# Altium schematic sheet DBG.SchDoc: DEBBUG
size A2; DrawnBy: ELIO F.; Engineer: ELIO F.; Revision: A; SheetNumber: 14; SheetTotal: 22
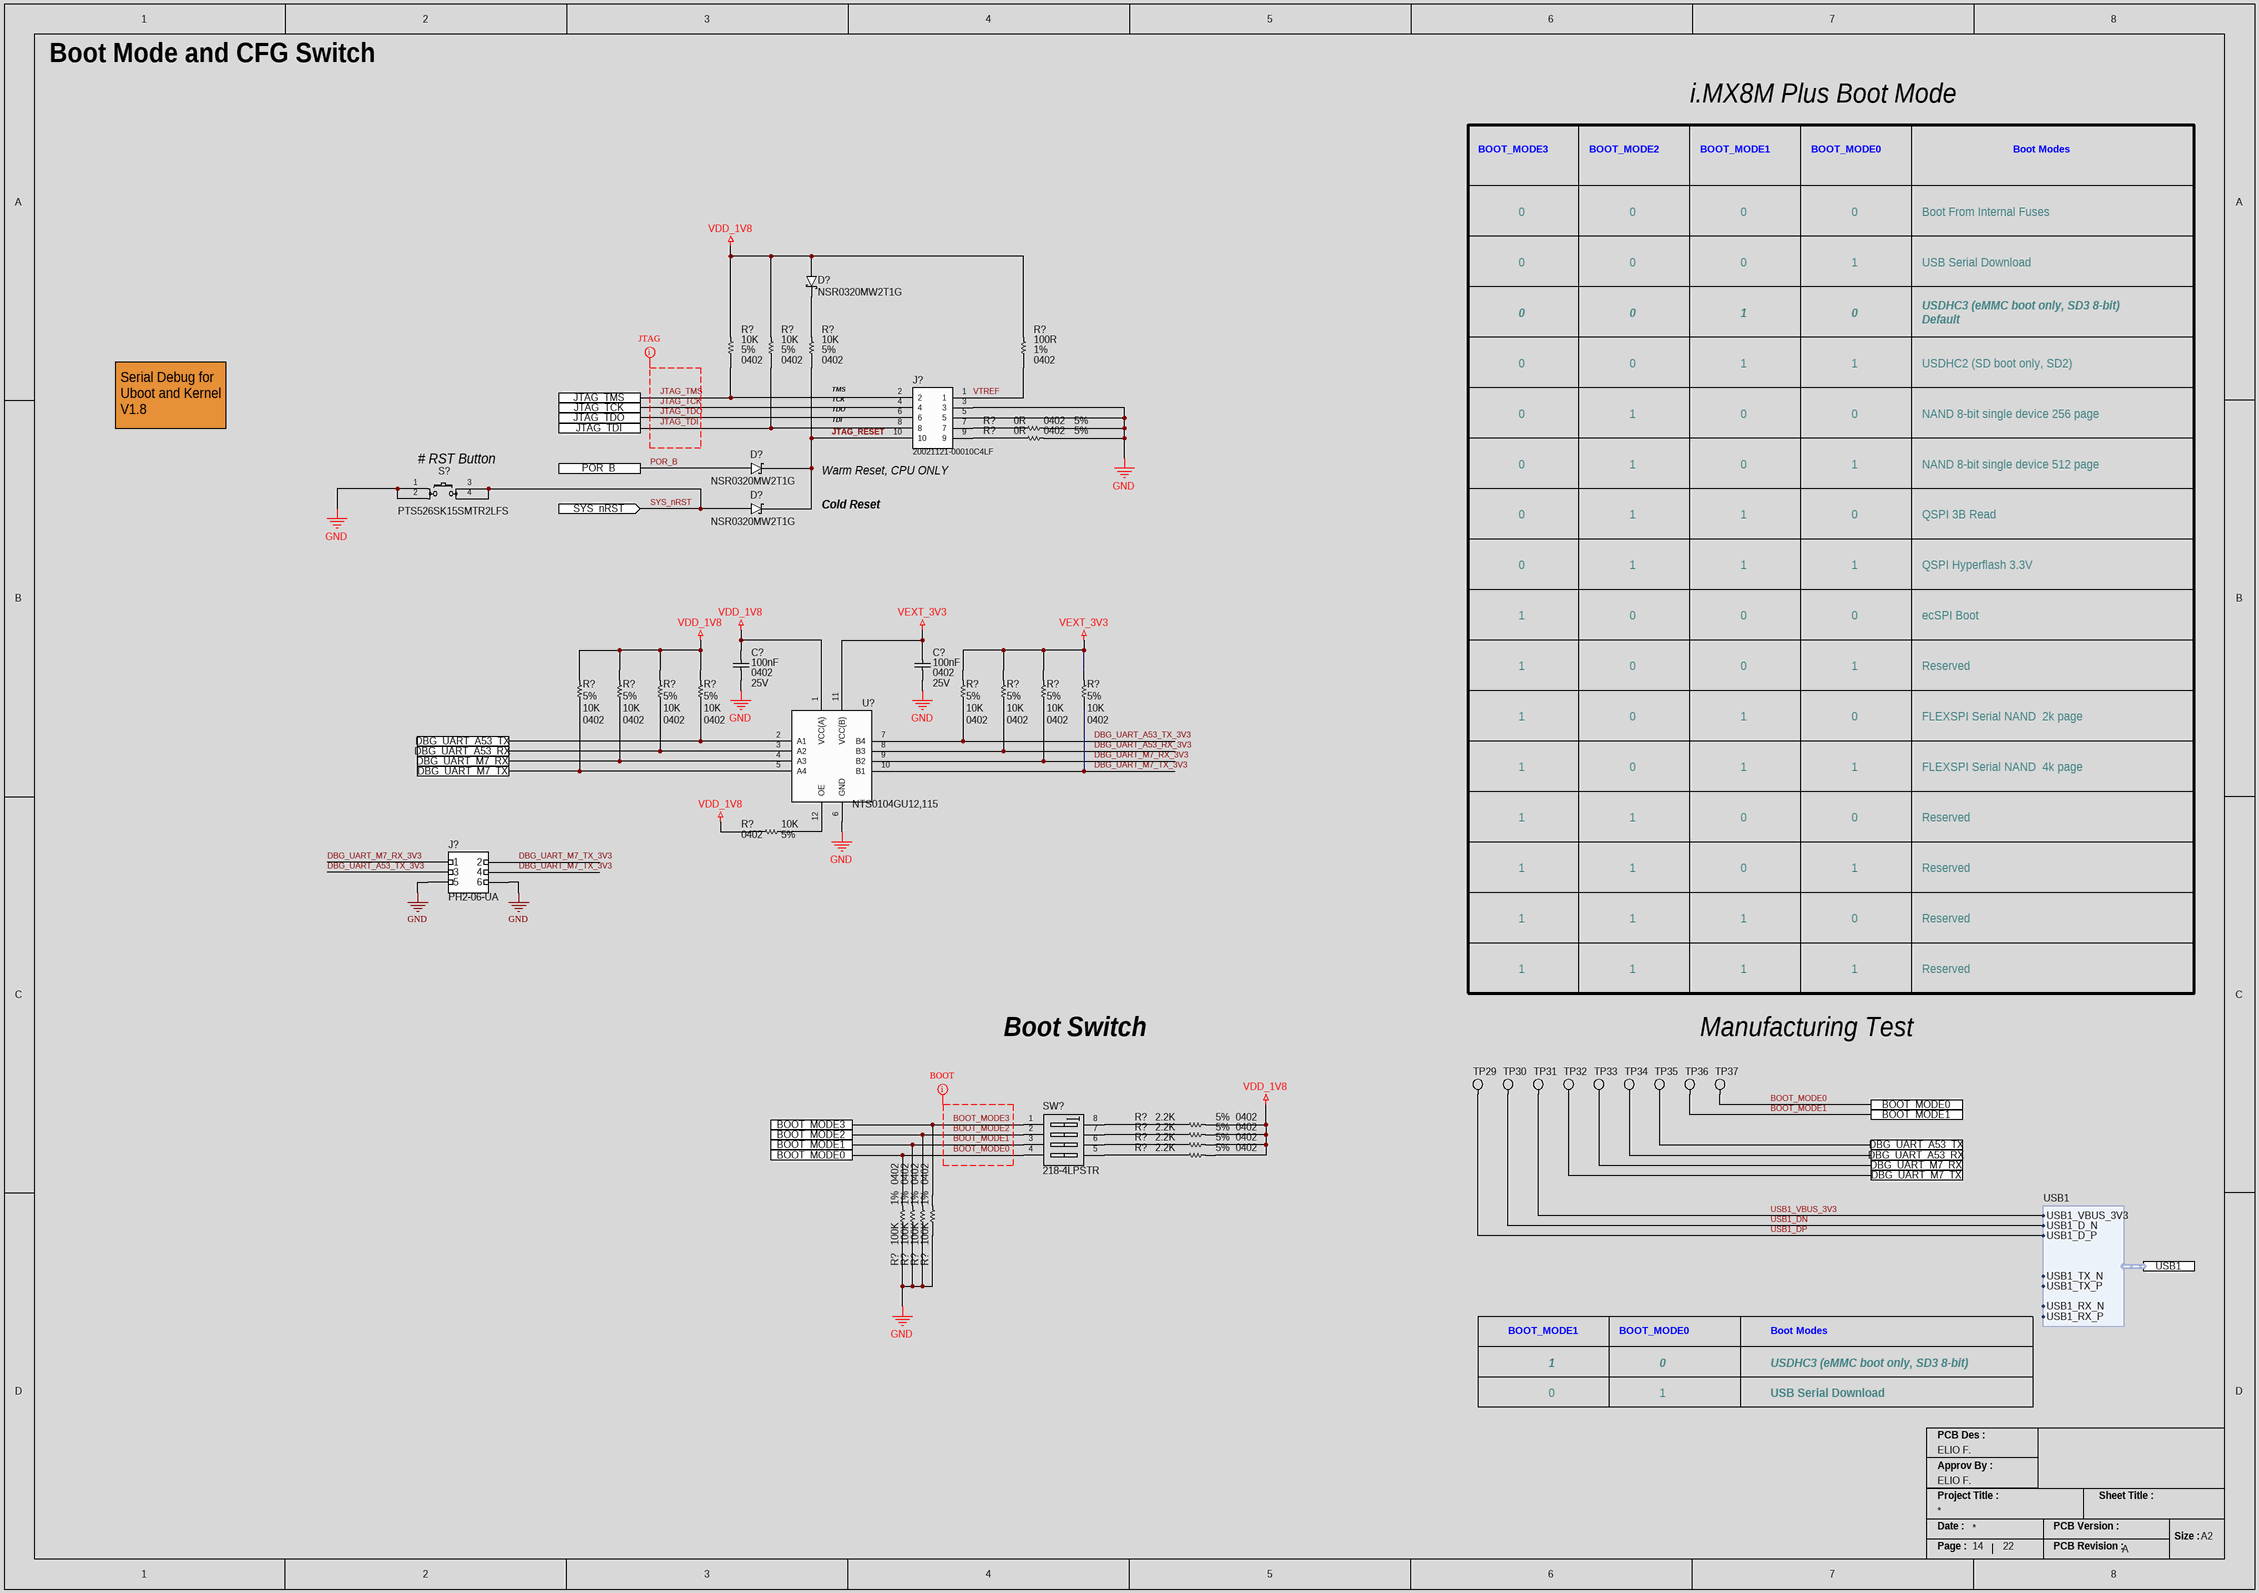
[diagram p0: DBG.SchDoc]

## Parts
(Parts that share a designator on the sheet are numbered #1, #2 ... from top to bottom, then left to right.)
C?#1  Capacitance: 100nF  Voltage Rating: 25V  Case/Package: 0402  [CAP_0402_CAPC1005X05N]  (hidden comment: CC0402KRX5R8BB104)
C?#2  Capacitance: 100nF  Voltage Rating: 25V  Case/Package: 0402  [CAP_0402_CAPC1005X05N]  (hidden comment: CC0402KRX5R8BB104)
D?#1  NSR0320MW2T1G  [DIO_SOD2512X110N]
D?#2  NSR0320MW2T1G  [DIO_SOD2512X110N]
D?#3  NSR0320MW2T1G  [DIO_SOD2512X110N]
J?#1  20021121-00010C4LF  [CONN_HDR_MALE_10P_2R]
J?#2  PH2-06-UA  [CONN_HDR_HDRV6W64P254_2X3_762X500X901P]
R?#1  Tolerance: 5%  Resistance: 10K  Case/Package: 0402  [RES_0402_RESC1005X04N]  (hidden comment: ERJ-2GEJ103X)
R?#2  Tolerance: 5%  Resistance: 10K  Case/Package: 0402  [RES_0402_RESC1005X04N]  (hidden comment: ERJ-2GEJ103X)
R?#3  Tolerance: 5%  Resistance: 10K  Case/Package: 0402  [RES_0402_RESC1005X04N]  (hidden comment: ERJ-2GEJ103X)
R?#4  Tolerance: 1%  Resistance: 100R  Case/Package: 0402  [RES_0402_RESC1005X04N]  (hidden comment: ERJ-2RKF1000X)
R?#5  Case Code (Imperial): 0402  Tolerance: 5%  Resistance: 0R  [RES_0402_RESC1005X04N]  (hidden comment: ERJ-2GE0R00X)
R?#6  Case Code (Imperial): 0402  Tolerance: 5%  Resistance: 0R  [RES_0402_RESC1005X04N]  (hidden comment: ERJ-2GE0R00X)
R?#7  Tolerance: 5%  Resistance: 10K  Case/Package: 0402  [RES_0402_RESC1005X04N]  (hidden comment: ERJ-2GEJ103X)
R?#8  Tolerance: 5%  Resistance: 10K  Case/Package: 0402  [RES_0402_RESC1005X04N]  (hidden comment: ERJ-2GEJ103X)
R?#9  Tolerance: 5%  Resistance: 10K  Case/Package: 0402  [RES_0402_RESC1005X04N]  (hidden comment: ERJ-2GEJ103X)
R?#10  Tolerance: 5%  Resistance: 10K  Case/Package: 0402  [RES_0402_RESC1005X04N]  (hidden comment: ERJ-2GEJ103X)
R?#11  Tolerance: 5%  Resistance: 10K  Case/Package: 0402  [RES_0402_RESC1005X04N]  (hidden comment: ERJ-2GEJ103X)
R?#12  Tolerance: 5%  Resistance: 10K  Case/Package: 0402  [RES_0402_RESC1005X04N]  (hidden comment: ERJ-2GEJ103X)
R?#13  Tolerance: 5%  Resistance: 10K  Case/Package: 0402  [RES_0402_RESC1005X04N]  (hidden comment: ERJ-2GEJ103X)
R?#14  Tolerance: 5%  Resistance: 10K  Case/Package: 0402  [RES_0402_RESC1005X04N]  (hidden comment: ERJ-2GEJ103X)
R?#15  Tolerance: 5%  Resistance: 10K  Case/Package: 0402  [RES_0402_RESC1005X04N]  (hidden comment: ERJ-2GEJ103X)
R?#16  Tolerance: 5%  Resistance: 2.2K  Case/Package: 0402  [RES_0402_RESC1005X04N]  (hidden comment: RC0402JR-072K2L)
R?#17  Tolerance: 5%  Resistance: 2.2K  Case/Package: 0402  [RES_0402_RESC1005X04N]  (hidden comment: RC0402JR-072K2L)
R?#18  Tolerance: 5%  Resistance: 2.2K  Case/Package: 0402  [RES_0402_RESC1005X04N]  (hidden comment: RC0402JR-072K2L)
R?#19  Tolerance: 5%  Resistance: 2.2K  Case/Package: 0402  [RES_0402_RESC1005X04N]  (hidden comment: RC0402JR-072K2L)
R?#20  Resistance: 100K  Tolerance: 1%  Case/Package: 0402  [RES_0402_RESC1005X04N]  (hidden comment: RC0402FR-07100KL)
R?#21  Resistance: 100K  Tolerance: 1%  Case/Package: 0402  [RES_0402_RESC1005X04N]  (hidden comment: RC0402FR-07100KL)
R?#22  Resistance: 100K  Tolerance: 1%  Case/Package: 0402  [RES_0402_RESC1005X04N]  (hidden comment: RC0402FR-07100KL)
R?#23  Resistance: 100K  Tolerance: 1%  Case/Package: 0402  [RES_0402_RESC1005X04N]  (hidden comment: RC0402FR-07100KL)
S?  PTS526SK15SMTR2LFS  [SWT_NO_PTS526SK15SMTR2LFS]
SW?  218-4LPSTR  [SW_DIP_SOIC127P844X265-8N]
TP29  NO COMPONENT  [TP_PAD_0.5MM_SMD_ROUND]  (value not drawn)  (no BOM)
TP30  NO COMPONENT  [TP_PAD_0.5MM_SMD_ROUND]  (value not drawn)  (no BOM)
TP31  NO COMPONENT  [TP_PAD_0.5MM_SMD_ROUND]  (value not drawn)  (no BOM)
TP32  NO COMPONENT  [TP_PAD_0.5MM_SMD_ROUND]  (value not drawn)  (no BOM)
TP33  NO COMPONENT  [TP_PAD_0.5MM_SMD_ROUND]  (value not drawn)  (no BOM)
TP34  NO COMPONENT  [TP_PAD_0.5MM_SMD_ROUND]  (value not drawn)  (no BOM)
TP35  NO COMPONENT  [TP_PAD_0.5MM_SMD_ROUND]  (value not drawn)  (no BOM)
TP36  NO COMPONENT  [TP_PAD_0.5MM_SMD_ROUND]  (value not drawn)  (no BOM)
TP37  NO COMPONENT  [TP_PAD_0.5MM_SMD_ROUND]  (value not drawn)  (no BOM)
U?  NTS0104GU12,115  [IC_LEVEL_TRASLATOR_XQFN12_0P4_1P8X2P1]

## Ports
BOOT_MODE0, BOOT_MODE1, BOOT_MODE2, BOOT_MODE3, DBG_UART_A53_RX, DBG_UART_A53_TX, DBG_UART_M7_RX, DBG_UART_M7_TX, JTAG_TCK, JTAG_TDI, JTAG_TDO, JTAG_TMS, POR_B, SYS_nRST (in), USB1 (harness USB1)

## Harnesses
USB1: USB1_VBUS_3V3, USB1_D_N, USB1_D_P, USB1_TX_N, USB1_TX_P, USB1_RX_N, USB1_RX_P

## Nets
GND: C?#1.1 C?#2.1 J?#1.3 J?#1.5 J?#2.5 J?#2.6 R?#5.2 R?#6.2 R?#20.1 R?#21.1 R?#22.1 R?#23.1 S?.1(COM_1) S?.2(COM2) U?.6(GND)
VDD_1V8: C?#1.2 D?#1.2(A) R?#1.2 R?#2.2 R?#4.2 R?#7.2 R?#8.2 R?#9.2 R?#10.2 R?#15.1 R?#16.2 R?#17.2 R?#18.2 R?#19.2 U?.1(VCC(A))
VEXT_3V3: C?#2.2 R?#11.2 R?#12.2 R?#13.2 R?#14.2 U?.11(VCC(B))
BOOT_MODE0: R?#20.2 SW?.4(A4) TP37.1 ; port BOOT_MODE0
BOOT_MODE1: R?#21.2 SW?.3(A3) TP36.1 ; port BOOT_MODE1
BOOT_MODE2: R?#22.2 SW?.2(A2) ; port BOOT_MODE2
BOOT_MODE3: R?#23.2 SW?.1(A1) ; port BOOT_MODE3
DBG_UART_A53_RX: R?#9.1 TP34.1 U?.3(A2) ; port DBG_UART_A53_RX
DBG_UART_A53_RX_3V3: R?#12.1 U?.8(B3)
DBG_UART_A53_TX: R?#10.1 TP35.1 U?.2(A1) ; port DBG_UART_A53_TX
DBG_UART_A53_TX_3V3: J?#2.3 R?#11.1 U?.7(B4)
DBG_UART_M7_RX: R?#8.1 TP33.1 U?.4(A3) ; port DBG_UART_M7_RX
DBG_UART_M7_RX_3V3: J?#2.1 R?#13.1 U?.9(B2)
DBG_UART_M7_TX: R?#7.1 TP32.1 U?.5(A4) ; port DBG_UART_M7_TX
DBG_UART_M7_TX_3V3: J?#2.2 J?#2.4 R?#14.1 U?.10(B1)
JTAG_RESET: D?#2.1(K) D?#3.1(K) J?#1.10 R?#3.1
JTAG_TCK: J?#1.4 ; port JTAG_TCK
JTAG_TDI: J?#1.8 R?#2.1 ; port JTAG_TDI
JTAG_TDO: J?#1.6 ; port JTAG_TDO
JTAG_TMS: J?#1.2 R?#1.1 ; port JTAG_TMS
POR_B: D?#2.2(A) ; port POR_B
SYS_nRST: D?#3.2(A) S?.3(NO1) S?.4(NO2) ; port SYS_nRST
USB1_DN: TP30.1 ; port USB1.USB1_D_N
USB1_DP: TP29.1 ; port USB1.USB1_D_P
USB1_VBUS_3V3: TP31.1 ; port USB1.USB1_VBUS_3V3
VTREF: J?#1.1 R?#4.1
NetD?#1_1: D?#1.1(K) R?#3.2
NetJ?#1_7: J?#1.7 R?#5.1
NetJ?#1_9: J?#1.9 R?#6.1
NetR?#15_2: R?#15.2 U?.12(OE)
NetR?#16_1: R?#16.1 SW?.8(B1)
NetR?#17_1: R?#17.1 SW?.7(B2)
NetR?#18_1: R?#18.1 SW?.6(B3)
NetR?#19_1: R?#19.1 SW?.5(B4)

## Layout directives
mark named BOOT: BOOT_MODE0, BOOT_MODE1, BOOT_MODE2, BOOT_MODE3
net class JTAG: JTAG_TCK, JTAG_TDI, JTAG_TDO, JTAG_TMS

## Notes on the sheet
- Boot Mode and CFG Switch
- i.MX8M Plus Boot Mode
- BOOT_MODE3
- BOOT_MODE2
- BOOT_MODE1
- BOOT_MODE0
- Boot Modes
- 0
- Boot From Internal Fuses
- 1
- USB Serial Download
- USDHC3 (eMMC boot only, SD3 8-bit)
  Default
- (near R?#3) TMS
- USDHC2 (SD boot only, SD2)
- Serial Debug for
  Uboot and Kernel V1.8
- TCK
- TDO
- TDI
- NAND 8-bit single device 256 page
- (near S?) # RST Button
- (near J?#1) Warm Reset, CPU ONLY
- NAND 8-bit single device 512 page
- Cold Reset
- QSPI 3B Read
- QSPI Hyperflash 3.3V
- ecSPI Boot
- Reserved
- FLEXSPI Serial NAND  2k page
- FLEXSPI Serial NAND  4k page
- Boot Switch
- Manufacturing Test
- USDHC3 (eMMC boot only, SD3 8-bit)
- PCB Des :
- Approv By :
- Project Title :
- Sheet Title :
- Date :
- Page :
- PCB Version :
- PCB Revision :
- Size :
- A2

## Library data of the parts
C?#1 C?#2 = CAP_100NF_25V_X7R_0402: Multilayer Ceramic Capacitor, 0.1 uF, 25 V, ± 10%, X7R, 0402 [1005 Metric]; Manufacturer: Yageo; Material: 4241ConductorMaterial; Dielectric: X5R; Temperature Coefficient: 30ppm/°C; Supplier 1: Digikey; Manufacturer Part Number: CC0402KRX5R8BB104; RoHS: Yes; Category: Ceramic Capacitors; Stock 1: 3706055; Pricing 1: 1=0.1, 10=0.037, 50=0.021, 100=0.0162, 500=0.01224, 1000=0.00961, 2500=0.00874, 5000=0.00804 (USD); Mount: Surface Mount; Case Code (Metric): 1005; Case Code (Imperial): 0402; Min Operating Temperature: -55°C; Max Operating Temperature: 85°C; Tolerance: 10%; Packaging: Tape and Reel; Voltage Rating (DC): 25V; Series: CC; RoHS Compliant: Yes; Lead Free: 5697LeadFree; Halogen Free: 5694HalogenFree; ComponentLink1URL: http://www.mouser.com/ds/2/447/UPY-GPHC_X5R_4V-to-50V_25-1131599.pdf?src-supplier=Mouser; ComponentLink1Description: http://www.mouser.com/ds/2/447/UPY-GPHC_X5R_4V-to-50V_25-1131599.pdf?src-supplier=Mouser; ComponentLink2URL: https://datasheet.octopart.com/CC0402KRX5R8BB104-Yageo-datasheet-137700082.pdf?src-supplier=Future+Electronics; ComponentLink2Description: https://datasheet.octopart.com/CC0402KRX5R8BB104-Yageo-datasheet-137700082.pdf?src-supplier=Future+Electronics; ComponentLink3URL: http://www.yageo.com/documents/recent/UPY-GPHC_X5R_4V-to-50V_25.pdf?src-supplier=Digikey; ComponentLink3Description: http://www.yageo.com/documents/recent/UPY-GPHC_X5R_4V-to-50V_25.pdf?src-supplier=Digikey; ComponentLink4URL: https://datasheet.octopart.com/CC0402KRX5R8BB104-Yageo-datasheet-140260304.pdf?src-supplier=Newark; ComponentLink4Description: https://datasheet.octopart.com/CC0402KRX5R8BB104-Yageo-datasheet-140260304.pdf?src-supplier=Newark; ComponentLink5URL: https://datasheet.octopart.com/CC0402KRX5R8BB104-Yageo-datasheet-170350636.pdf?src-supplier=Future+Electronics; ComponentLink5Description: https://datasheet.octopart.com/CC0402KRX5R8BB104-Yageo-datasheet-170350636.pdf?src-supplier=Future+Electronics; ComponentLink6URL: http://www.yageo.com/documents/recent/UPY-GPHC_X5R_4V-to-50V-16.pdf?src-supplier=Future+Electronics; ComponentLink6Description: http://www.yageo.com/documents/recent/UPY-GPHC_X5R_4V-to-50V-16.pdf?src-supplier=Future+Electronics; Supplier Part Number 1: 311-1697-6-ND
D?#1-D?#3 = DIO_SCTKY_20V_1A_NSR0320MW2T1G: VR=20V IF=1A 29pF P=200mW; Manufacturer: ON Semiconductor; Forward Current: 1A; Max Reverse Current: 50uA; Forward Voltage: 500mV; Max Repetitive Reverse Voltage (Vrrm): 23V; Max Forward Surge Current (Ifsm): 5A; Power Dissipation: 200mW; Element Configuration: Single; Max Reverse Voltage (DC): 20V; Supplier 1: Digikey; Manufacturer Part Number: NSR0320MW2T1G; RoHS: Yes; Category: Schottky Diodes; Stock 1: 158845; Pricing 1: 1=0.32, 10=0.223, 100=0.1089, 500=0.09082, 1000=0.0631 (USD); Case/Package: SOD-323-2; Number of Pins: 2; Min Operating Temperature: -55°C; Max Operating Temperature: 125°C; Package Quantity: 1; Packaging: Tape and Reel; Average Rectified Current: 1A; Max Reverse Leakage Current: 50uA; Series: -; Length: 1.8mm; Width: 1.35mm; Height: 0.9mm; Radiation Hardening: No; Reach SVHC Compliant: No; Lead Free: Lead Free; RoHS Compliant: Yes; ComponentLink1URL: https://datasheet.ciiva.com/915/nsr0320mw2t1-d-915506.pdf?src-supplier=Avnet; ComponentLink1Description: https://datasheet.ciiva.com/915/nsr0320mw2t1-d-915506.pdf?src-supplier=Avnet; ComponentLink2URL: https://datasheet.ciiva.com/22659/1708337-22659115.pdf?src-supplier=Element14; ComponentLink2Description: https://datasheet.ciiva.com/22659/1708337-22659115.pdf?src-supplier=Element14; ComponentLink3URL: https://datasheet.ciiva.com/16210/nsr0320mw2t1-d-16210139.pdf?src-supplier=Future+Electronics; ComponentLink3Description: https://datasheet.ciiva.com/16210/nsr0320mw2t1-d-16210139.pdf?src-supplier=Future+Electronics; Supplier Part Number 1: NSR0320MW2T1GOSCT-ND
J?#1 = CONN_HEADER_MALE_10P_2R_1.27MM: Conn Unshrouded Header HDR 10 POS 1.27mm Solder ST Top Entry SMD Minitek127® T/R; Manufacturer: Amphenol ICC / FCI; Number of Contacts: 10; Current Rating: 1A; Voltage Rating: 125V; Contact Resistance: 30mR; Row Spacing: 0.05inch; Stack Height: 3mm; Supplier 1: Newark; Manufacturer Part Number: 20021121-00010C4LF; RoHS: No; Category: Headers and Wire Housings; Stock 1: 9600; Pricing 1: 1=0.363, 1200=0.363, 2400=0.363, 4800=0.363, 7200=0.363, 12000=0.363 (USD); Mount: Surface Mount; Contact Plating: Gold; Color: Black; Contact Material: Copper Alloy,Copper; Housing Material: Thermoplastic; Housing Color: Black; Min Operating Temperature: -40°C; Max Operating Temperature: 85°C; Series: Minitek; Packaging: Tape and Reel; Number of Rows: 2; Termination: Solder; Package Quantity: 600; Connector Type: Header; Contact Type: Male Pin; Number of Positions: 10; Orientation: Straight; Max Voltage Rating (AC): 125V; Length: 6.35mm; Pitch: 1.27mm; Contact Mating Length: 0.12inch; Depth: 3.4mm; Radiation Hardening: No; Reach SVHC Compliant: No; Supplier Part Number 1: 28X2682
J?#2 = CONN_HEADER_MALE_6P_2R_2.54mm_PH2-06-UA: Conn Unshrouded Header HDR 6 POS 2.54mm Solder ST Thru-Hole Bag; Manufacturer: Adam Equipment; Supplier 1: Digi-Key; Manufacturer Part Number: PH2-06-UA; RoHS: Yes; Category: Connectors; Stock 1: 52253; Pricing 1: 1=0.13, 10=0.1, 100=0.0735, 500=0.06084, 1000=0.05324, 5000=0.04563, 10000=0.04436 (USD); Lead Free: Lead Free; ComponentLink1URL: https://datasheet.ciiva.com/16479/page-292-295-16479745.pdf?src-supplier=Future+Electronics; ComponentLink1Description: https://datasheet.ciiva.com/16479/page-292-295-16479745.pdf?src-supplier=Future+Electronics; Supplier Part Number 1: 2057-PH2-06-UA-ND
R?#1-R?#3 R?#7-R?#15 = RES_10K_5%_100mW_0402: Res Thick Film 0402 10K Ohm 5% 1/10W ±200ppm/°C Molded SMD Punched Carrier T/R; Manufacturer: Panasonic; Power Rating: 100mW; Voltage Rating: 50V; Supplier 1: Digi-Key; Manufacturer Part Number: ERJ-2GEJ103X; RoHS: Yes; Category: Chip SMD Resistors; Stock 1: 4696986; Pricing 1: 1=0.1, 10=0.021, 50=0.0132, 100=0.011, 500=0.00744, 1000=0.00639, 5000=0.00464 (USD); Mount: Surface Mount; Contact Plating: Tin; Case Code (Metric): 1005; Case Code (Imperial): 0402; Size Code: 0402; Min Operating Temperature: -55°C; Max Operating Temperature: 155°C; Temperature Coefficient: 200ppm/°C; Packaging: Cut Tape; Resistor Type: Thick Film; Package Quantity: 10000; Number of Terminations: 2; Termination: SMD/SMT; Max Power Dissipation: 100mW; Features: Automotive AEC-Q200; Series: ERJ; Resistance Tolerance: 5%; Technology: THICK FILM; Voltage Rating (DC): 50V; Length: 1mm; Width: 0.5mm; Height: 0.35mm; Depth: 0.5mm; Ratings: AEC-Q200; Radiation Hardening: No; Reach SVHC Compliant: No; RoHS Compliant: Yes; Lead Free: 5697LeadFree; ComponentLink1URL: https://datasheet.ciiva.com/27055/1935721-27055112.pdf?src-supplier=Jameco; ComponentLink1Description: https://datasheet.ciiva.com/27055/1935721-27055112.pdf?src-supplier=Jameco; ComponentLink2URL: https://datasheet.ciiva.com/11821/0900766b80f806dd-11821170.pdf?src-supplier=Rs; ComponentLink2Description: https://datasheet.ciiva.com/11821/0900766b80f806dd-11821170.pdf?src-supplier=Rs; ComponentLink3URL: https://datasheet.ciiva.com/43460/1678796-43460391.pdf?src-supplier=Farnell; ComponentLink3Description: https://datasheet.ciiva.com/43460/1678796-43460391.pdf?src-supplier=Farnell; ComponentLink4URL: https://datasheet.ciiva.com/22785/1678796-22785949.pdf?src-supplier=Farnell; ComponentLink4Description: https://datasheet.ciiva.com/22785/1678796-22785949.pdf?src-supplier=Farnell; ComponentLink5URL: https://datasheet.ciiva.com/46371/1678796-46371910.pdf?src-supplier=Element14; ComponentLink5Description: https://datasheet.ciiva.com/46371/1678796-46371910.pdf?src-supplier=Element14; ComponentLink6URL: https://datasheet.ciiva.com/28514/1678796-28514154.pdf?src-supplier=Element14; ComponentLink6Description: https://datasheet.ciiva.com/28514/1678796-28514154.pdf?src-supplier=Element14; ComponentLink7URL: https://datasheet.ciiva.com/24070/aoa0000ce1-37422-24070679.pdf?src-supplier=Mouser; ComponentLink7Description: https://datasheet.ciiva.com/24070/aoa0000ce1-37422-24070679.pdf?src-supplier=Mouser; ComponentLink8URL: https://datasheet.ciiva.com/16767/70260739-16767130.pdf?src-supplier=Allied+Electronics; ComponentLink8Description: https://datasheet.ciiva.com/16767/70260739-16767130.pdf?src-supplier=Allied+Electronics; ComponentLink9URL: https://datasheet.ciiva.com/16774/70260739-16774504.pdf?src-supplier=Allied+Electronics; ComponentLink9Description: https://datasheet.ciiva.com/16774/70260739-16774504.pdf?src-supplier=Allied+Electronics; ComponentLink10URL: https://datasheet.ciiva.com/9194/aoa0000ce1-9194140.pdf?src-supplier=Avnet; ComponentLink10Description: https://datasheet.ciiva.com/9194/aoa0000ce1-9194140.pdf?src-supplier=Avnet; Supplier Part Number 1: P10KJCT-ND
R?#4 = RES_100R_1%_100mW_0402: Resistor Thick Film 0402 100 Ohm 1% 1/10W 100ppm/C Molded SMD Punched Carrier T/R; Manufacturer: Panasonic; Temperature Coefficient: 100ppm/°C; Power Rating: 100mW; Voltage Rating: 50V; Supplier 1: Mouser; Manufacturer Part Number: ERJ-2RKF1000X; RoHS: Yes; Category: Chip SMD Resistors; Stock 1: 10699571; Pricing 1: 1=0.1, 10=0.015, 50=0.015, 100=0.009, 1000=0.006, 10000=0.004 (USD); Mount: Surface Mount; Number of Pins: 2; Contact Plating: Tin; Case Code (Imperial): 0402; Case Code (Metric): 1005; Size Code: 0402; Min Operating Temperature: -55°C; Max Operating Temperature: 155°C; Resistor Type: Thick Film; Packaging: Tape and Reel; Package Quantity: 1; Termination: SMD/SMT; Number of Terminations: 2; Max Power Dissipation: 100mW; Voltage Rating (DC): 50V; Features: Automotive AEC-Q200; Series: ERJ; Technology: THICK FILM; Resistance Tolerance: 1%; Construction: Rectangular; Length: 1mm; Width: 0.5mm; Height: 0.35mm; Depth: 0.5mm; Radiation Hardening: No; Reach SVHC Compliant: No; Military Standard: Not; Lead Free: Lead Free; RoHS Compliant: Yes; ComponentLink1URL: https://datasheet.ciiva.com/27056/2007311-27056035.pdf?src-supplier=Jameco; ComponentLink1Description: https://datasheet.ciiva.com/27056/2007311-27056035.pdf?src-supplier=Jameco; ComponentLink2URL: https://datasheet.ciiva.com/11821/0900766b80f80784-11821173.pdf?src-supplier=Rs; ComponentLink2Description: https://datasheet.ciiva.com/11821/0900766b80f80784-11821173.pdf?src-supplier=Rs; ComponentLink3URL: https://datasheet.ciiva.com/7830/426256-7830973.pdf?src-supplier=Element14; ComponentLink3Description: https://datasheet.ciiva.com/7830/426256-7830973.pdf?src-supplier=Element14; ComponentLink4URL: https://datasheet.ciiva.com/43467/1678782-43467223.pdf?src-supplier=Farnell; ComponentLink4Description: https://datasheet.ciiva.com/43467/1678782-43467223.pdf?src-supplier=Farnell; ComponentLink5URL: https://datasheet.ciiva.com/28514/1678782-28514175.pdf?src-supplier=Element14; ComponentLink5Description: https://datasheet.ciiva.com/28514/1678782-28514175.pdf?src-supplier=Element14; ComponentLink6URL: https://datasheet.ciiva.com/46372/1678782-46372741.pdf?src-supplier=Element14; ComponentLink6Description: https://datasheet.ciiva.com/46372/1678782-46372741.pdf?src-supplier=Element14; ComponentLink7URL: https://datasheet.ciiva.com/16776/70260748-16776427.pdf?src-supplier=Allied+Electronics; ComponentLink7Description: https://datasheet.ciiva.com/16776/70260748-16776427.pdf?src-supplier=Allied+Electronics; ComponentLink8URL: https://datasheet.ciiva.com/9186/aoa0000ce2-9186683.pdf?src-supplier=Avnet; ComponentLink8Description: https://datasheet.ciiva.com/9186/aoa0000ce2-9186683.pdf?src-supplier=Avnet; ComponentLink9URL: https://datasheet.ciiva.com/16199/aoa0000ce2-16199575.pdf?src-supplier=Future+Electronics; ComponentLink9Description: https://datasheet.ciiva.com/16199/aoa0000ce2-16199575.pdf?src-supplier=Future+Electronics; ComponentLink10URL: https://datasheet.ciiva.com/48531/aoa0000ce2-48531067.pdf?src-supplier=Avnet; ComponentLink10Description: https://datasheet.ciiva.com/48531/aoa0000ce2-48531067.pdf?src-supplier=Avnet; ComponentLink11URL: https://datasheet.ciiva.com/30260/aoa0000ce2-30260809.pdf?src-supplier=Onlinecomponents.com; ComponentLink11Description: https://datasheet.ciiva.com/30260/aoa0000ce2-30260809.pdf?src-supplier=Onlinecomponents.com; Supplier Part Number 1: 667-ERJ-2RKF1000X
R?#5 R?#6 = RES_0R_5%_100mW_0402: SMD Chip Resistor, Jumper, 0 ohm, 100 mW, 0402 [1005 Metric], Thick Film, General Purpose; Manufacturer: Panasonic; Power Rating: 100mW; Voltage Rating: 50V; Temperature Coefficient: 600ppm/°C; Supplier 1: Mouser; Manufacturer Part Number: ERJ-2GE0R00X; RoHS: Yes; Category: Chip SMD Resistors; Stock 1: 10989354; Pricing 1: 1=0.1, 10=0.013, 50=0.013, 100=0.006, 1000=0.004, 2500=0.003, 10000=0.003 (USD); Mount: Surface Mount; Case/Package: 0402; Contact Plating: Tin; Case Code (Metric): 1005; Size Code: 0402; Min Operating Temperature: -55°C; Max Operating Temperature: 155°C; Resistor Type: Thick Film; Packaging: Cut Tape; Package Quantity: 10000; Number of Terminations: 2; Termination: SMD/SMT; Max Power Dissipation: 100mW; Voltage Rating (DC): 50V; Features: Automotive AEC-Q200; Series: ERJ; Construction: Rectangular; Technology: THICK FILM; Length: 1mm; Width: 0.5mm; Height: 0.35mm; Depth: 0.5mm; Ratings: AEC-Q200; Radiation Hardening: No; Reach SVHC Compliant: No; Military Standard: Not; Lead Free: Lead Free; RoHS Compliant: Yes; ComponentLink1URL: https://datasheet.ciiva.com/11821/0900766b80f806dd-11821176.pdf?src-supplier=Rs; ComponentLink1Description: https://datasheet.ciiva.com/11821/0900766b80f806dd-11821176.pdf?src-supplier=Rs; ComponentLink2URL: https://datasheet.ciiva.com/43460/1678796-43460347.pdf?src-supplier=Farnell; ComponentLink2Description: https://datasheet.ciiva.com/43460/1678796-43460347.pdf?src-supplier=Farnell; ComponentLink3URL: https://datasheet.ciiva.com/46389/1678796-46389518.pdf?src-supplier=Element14; ComponentLink3Description: https://datasheet.ciiva.com/46389/1678796-46389518.pdf?src-supplier=Element14; ComponentLink4URL: https://datasheet.ciiva.com/5959/1678796-5959692.pdf?src-supplier=Farnell; ComponentLink4Description: https://datasheet.ciiva.com/5959/1678796-5959692.pdf?src-supplier=Farnell; ComponentLink5URL: https://datasheet.ciiva.com/28695/1678796-28695758.pdf?src-supplier=Element14; ComponentLink5Description: https://datasheet.ciiva.com/28695/1678796-28695758.pdf?src-supplier=Element14; ComponentLink6URL: https://datasheet.ciiva.com/16783/70260739-16783734.pdf?src-supplier=Allied+Electronics; ComponentLink6Description: https://datasheet.ciiva.com/16783/70260739-16783734.pdf?src-supplier=Allied+Electronics; ComponentLink7URL: https://datasheet.ciiva.com/16778/70260739-16778335.pdf?src-supplier=Allied+Electronics; ComponentLink7Description: https://datasheet.ciiva.com/16778/70260739-16778335.pdf?src-supplier=Allied+Electronics; ComponentLink8URL: https://datasheet.ciiva.com/48531/aoa0000ce1-48531077.pdf?src-supplier=Avnet; ComponentLink8Description: https://datasheet.ciiva.com/48531/aoa0000ce1-48531077.pdf?src-supplier=Avnet; ComponentLink9URL: https://datasheet.ciiva.com/30097/4aoa0000ce1-30097116.pdf?src-supplier=Onlinecomponents.com; ComponentLink9Description: https://datasheet.ciiva.com/30097/4aoa0000ce1-30097116.pdf?src-supplier=Onlinecomponents.com; Supplier Part Number 1: 667-ERJ-2GE0R00X
R?#16-R?#19 = RES_2.2K_5%_63mW_0402: SMD Chip Resistor, 2.2 kOhm, ± 5%, 63 mW, 0402 [1005 Metric], Thick Film, General Purpose; Manufacturer: Yageo; Power Rating: 62.5mW; Voltage Rating: 50V; Temperature Coefficient: 100ppm/°C; Max Power Dissipation: 63mW; Supplier 1: Mouser; Manufacturer Part Number: RC0402JR-072K2L; RoHS: Yes; Category: Chip SMD Resistors; Stock 1: 27488; Pricing 1: 1=0.1, 10=0.011, 50=0.011, 100=0.006, 1000=0.005, 10000=0.002 (USD); Case Code (Metric): 1005; Case Code (Imperial): 0402; Weight: 2.3E-05oz; Min Operating Temperature: -55°C; Max Operating Temperature: 155°C; Package Quantity: 1; Packaging: Tape and Reel; Resistor Type: Thick Film; Number of Terminations: 2; Termination: SMD/SMT; Working Voltage: 50V; Features: Moisture Resistant; Series: RC; Resistance Tolerance: 5%; Construction: Rectangular; Technology: THICK FILM; Voltage Rating (AC): 50V; Length: 1mm; Width: 0.02inch; Height: 0.016inch; Depth: 0.5mm; Reach SVHC Compliant: No; Military Standard: Not; RoHS Compliant: Yes; Lead Free: 5697LeadFree; ComponentLink1URL: https://datasheet.ciiva.com/2518/pyu-r-int-thick-7-2518881.pdf?src-supplier=Digikey; ComponentLink1Description: https://datasheet.ciiva.com/2518/pyu-r-int-thick-7-2518881.pdf?src-supplier=Digikey; ComponentLink2URL: https://datasheet.ciiva.com/2518/pyu-r-int-thick-7-2518882.pdf?src-supplier=Digikey; ComponentLink2Description: https://datasheet.ciiva.com/2518/pyu-r-int-thick-7-2518882.pdf?src-supplier=Digikey; ComponentLink3URL: https://datasheet.ciiva.com/2518/pyu-r-int-thick-7-2518880.pdf?src-supplier=Digikey; ComponentLink3Description: https://datasheet.ciiva.com/2518/pyu-r-int-thick-7-2518880.pdf?src-supplier=Digikey; ComponentLink4URL: https://datasheet.ciiva.com/12577/pyu-rc0402-51-rohs-l-6-r-12577433.pdf?src-supplier=Mouser; ComponentLink4Description: https://datasheet.ciiva.com/12577/pyu-rc0402-51-rohs-l-6-r-12577433.pdf?src-supplier=Mouser; ComponentLink5URL: https://datasheet.ciiva.com/7850/1018594-7850191.pdf?src-supplier=Element14; ComponentLink5Description: https://datasheet.ciiva.com/7850/1018594-7850191.pdf?src-supplier=Element14; ComponentLink6URL: https://datasheet.ciiva.com/7850/1018594-7850190.pdf?src-supplier=Element14; ComponentLink6Description: https://datasheet.ciiva.com/7850/1018594-7850190.pdf?src-supplier=Element14; ComponentLink7URL: https://datasheet.ciiva.com/16741/pyu-rc0402-51-rohs-l-6-r-16741086.pdf?src-supplier=Future+Electronics; ComponentLink7Description: https://datasheet.ciiva.com/16741/pyu-rc0402-51-rohs-l-6-r-16741086.pdf?src-supplier=Future+Electronics; ComponentLink8URL: https://datasheet.ciiva.com/15189/getdatasheetpartid-327800-15189558.pdf?src-supplier=Verical; ComponentLink8Description: https://datasheet.ciiva.com/15189/getdatasheetpartid-327800-15189558.pdf?src-supplier=Verical; Supplier Part Number 1: 603-RC0402JR-072K2L
R?#20-R?#23 = RES_100K_1%_100mW_0402: SMD Chip Resistor, 100 kOhm, ± 1%, 63 mW, 0402 [1005 Metric], Thick Film, General Purpose; Manufacturer: Yageo; Temperature Coefficient: 100ppm/°C; Power Rating: 63mW; Voltage Rating: 50V; Supplier 1: Digi-Key; Manufacturer Part Number: RC0402FR-07100KL; RoHS: Yes; Category: Chip SMD Resistors; Stock 1: 27579413; Pricing 1: 1=0.1, 10=0.014, 50=0.0084, 100=0.007, 500=0.00464, 1000=0.00396, 5000=0.00282 (USD); Case Code (Metric): 1005; Case Code (Imperial): 0402; Min Operating Temperature: -55°C; Max Operating Temperature: 155°C; Resistor Type: Thick Film; Packaging: Tape and Reel; Package Quantity: 1; Number of Terminations: 2; Termination: SMD/SMT; Max Power Dissipation: 63mW; Features: Moisture Resistant; Series: RC; Resistance Tolerance: 1%; Construction: Rectangular; Technology: THICK FILM; Voltage Rating (AC): 50V; Length: 0.039inch; Width: 0.02inch; Height: 0.016inch; Depth: 0.5mm; Reach SVHC Compliant: No; RoHS Compliant: Yes; Lead Free: 5697LeadFree; Military Standard: Not; ComponentLink1URL: https://datasheet.ciiva.com/11819/0900766b80c66297-11819452.pdf?src-supplier=Rs; ComponentLink1Description: https://datasheet.ciiva.com/11819/0900766b80c66297-11819452.pdf?src-supplier=Rs; ComponentLink2URL: https://datasheet.ciiva.com/22747/1018594-22747509.pdf?src-supplier=Element14; ComponentLink2Description: https://datasheet.ciiva.com/22747/1018594-22747509.pdf?src-supplier=Element14; ComponentLink3URL: https://datasheet.ciiva.com/2453/pyu-r-int-thick-7-2453362.pdf?src-supplier=Digi-Key; ComponentLink3Description: https://datasheet.ciiva.com/2453/pyu-r-int-thick-7-2453362.pdf?src-supplier=Digi-Key; ComponentLink4URL: https://datasheet.ciiva.com/12667/pyu-rc0402-51-rohs-l-6-r-12667930.pdf?src-supplier=Mouser; ComponentLink4Description: https://datasheet.ciiva.com/12667/pyu-rc0402-51-rohs-l-6-r-12667930.pdf?src-supplier=Mouser; ComponentLink5URL: https://datasheet.ciiva.com/15189/getdatasheetpartid-323696-15189334.pdf?src-supplier=Verical; ComponentLink5Description: https://datasheet.ciiva.com/15189/getdatasheetpartid-323696-15189334.pdf?src-supplier=Verical; ComponentLink6URL: https://datasheet.ciiva.com/2453/pyu-r-int-thick-7-2453363.pdf?src-supplier=Digi-Key; ComponentLink6Description: https://datasheet.ciiva.com/2453/pyu-r-int-thick-7-2453363.pdf?src-supplier=Digi-Key; ComponentLink7URL: https://datasheet.ciiva.com/2453/pyu-r-int-thick-7-2453361.pdf?src-supplier=Digi-Key; ComponentLink7Description: https://datasheet.ciiva.com/2453/pyu-r-int-thick-7-2453361.pdf?src-supplier=Digi-Key; Supplier Part Number 1: 311-100KLRCT-ND
S? = SWITCH_NO_SPST_0.05A: Switch Tactile N.O. SPST Round Button Gull Wing 0.05A 12VDC 200000Cycles 2.55N SMD T/R; Manufacturer: ITT C&K; Supplier 1: Digi-Key; Manufacturer Part Number: PTS526SK15SMTR2LFS; RoHS: No; Category: Uncategorized; Stock 1: 382158; Pricing 1: 1=0.12, 10=0.12, 25=0.114, 100=0.1035, 250=0.09732, 500=0.08904, 1000=0.07454 (USD); Supplier Part Number 1: CKN12221-6-ND
SW? = SWITCH_DIP_4P_25mA_218-4LPSTR: Switch DIP ON OFF SPST 4 Recessed Slide 0.025A 24VDC Gull Wing 1000Cycles 1.27mm SMD T/R; Manufacturer: CTS; Number of Positions: 4; Voltage Rating (DC): 24V; Actuator Type: Slide (Standard); Max Current Rating: 25mA; Washable: Yes; Supplier 1: Digi-Key; Manufacturer Part Number: 218-4LPSTR; RoHS: Yes; Category: DIP Switches; Stock 1: 12605; Pricing 1: 1=1.08, 10=1.041, 25=0.978, 100=0.8449, 250=0.76996, 500=0.71586, 1000=0.66592 (USD); Mount: Surface Mount; Contact Material: Copper; Contact Plating: Gold; Mechanical Life: 1000Cycles; Min Operating Temperature: -55°C; Max Operating Temperature: 85°C; Throw Configuration: SPST; Packaging: Tape and Reel; Electrical Life: 1000Cycles; Series: 218; Max Voltage Rating (DC): 24V; Termination: Gull Wing; Orientation: Straight; Package Quantity: 2000; Length: 6.25mm; Depth: 8.44mm; Radiation Hardening: No; Lead Free: Lead Free; RoHS Compliant: Yes; ComponentLink1URL: https://datasheet.ciiva.com/8676/218-8676896.pdf?src-supplier=Avnet; ComponentLink1Description: https://datasheet.ciiva.com/8676/218-8676896.pdf?src-supplier=Avnet; ComponentLink2URL: https://datasheet.ciiva.com/8082/218-8082342.pdf?src-supplier=Avnet; ComponentLink2Description: https://datasheet.ciiva.com/8082/218-8082342.pdf?src-supplier=Avnet; ComponentLink3URL: https://datasheet.ciiva.com/16303/218-16303941.pdf?src-supplier=Future+Electronics; ComponentLink3Description: https://datasheet.ciiva.com/16303/218-16303941.pdf?src-supplier=Future+Electronics; ComponentLink4URL: https://datasheet.ciiva.com/15184/getdatasheetpartid-141001-15184860.pdf?src-supplier=Verical; ComponentLink4Description: https://datasheet.ciiva.com/15184/getdatasheetpartid-141001-15184860.pdf?src-supplier=Verical; Supplier Part Number 1: CT3110CT-ND
TP29-TP37 = TP_PAD_SMD_SMALL: Test Point, SMD pad, round, 1.5mm, 1.6mm, 3mm diameter
U? = IC_LEVEL_TRASLATOR_NTS0104GU12,115: NTS0104 Series 50 Mbps Dual Supply 3-ST O-DRN Translating Transceiver- XQFN-12; Manufacturer: NXP Semiconductors; Logic Function: Translator; Low Level Output Current: 1mA; High Level Output Current: -20uA; Quiescent Current: 45uA; Data Rate: 50Mbps; Number of Channels: 4; Propagation Delay: 4.4ns; Max Supply Voltage: 5.5V; Min Supply Voltage: 1.65V; Max Power Dissipation: 250mW; Turn-On Delay Time: 5.8ns; Output Type: Voltage; Supplier 1: Digikey; Manufacturer Part Number: NTS0104GU12,115; RoHS: Yes; Category: Voltage Level Shifters; Stock 1: 126626; Pricing 1: 1=1.16, 10=1.034, 25=0.982, 100=0.8065, 250=0.75396, 500=0.66628, 1000=0.52601 (USD); Mount: Surface Mount; Number of Pins: 12; Min Operating Temperature: -40°C; Max Operating Temperature: 125°C; Packaging: Tape and Reel; Package Quantity: 1; Number of Bits: 4; Series: -; Lead Free: Lead Free; RoHS Compliant: Yes; ComponentLink1URL: https://datasheet.ciiva.com/1899/nts0104-1899088.pdf?src-supplier=Digikey; ComponentLink1Description: https://datasheet.ciiva.com/1899/nts0104-1899088.pdf?src-supplier=Digikey; ComponentLink2URL: https://datasheet.ciiva.com/4834/nts0104-92130-4834865.pdf?src-supplier=Mouser; ComponentLink2Description: https://datasheet.ciiva.com/4834/nts0104-92130-4834865.pdf?src-supplier=Mouser; ComponentLink3URL: https://datasheet.ciiva.com/1899/nts0104-1899089.pdf?src-supplier=Digikey; ComponentLink3Description: https://datasheet.ciiva.com/1899/nts0104-1899089.pdf?src-supplier=Digikey; ComponentLink4URL: https://datasheet.ciiva.com/1899/nts0104-1899090.pdf?src-supplier=Digikey; ComponentLink4Description: https://datasheet.ciiva.com/1899/nts0104-1899090.pdf?src-supplier=Digikey; ComponentLink5URL: https://datasheet.ciiva.com/8244/nts0104-8244168.pdf?src-supplier=Avnet; ComponentLink5Description: https://datasheet.ciiva.com/8244/nts0104-8244168.pdf?src-supplier=Avnet; Supplier Part Number 1: 568-8408-1-ND